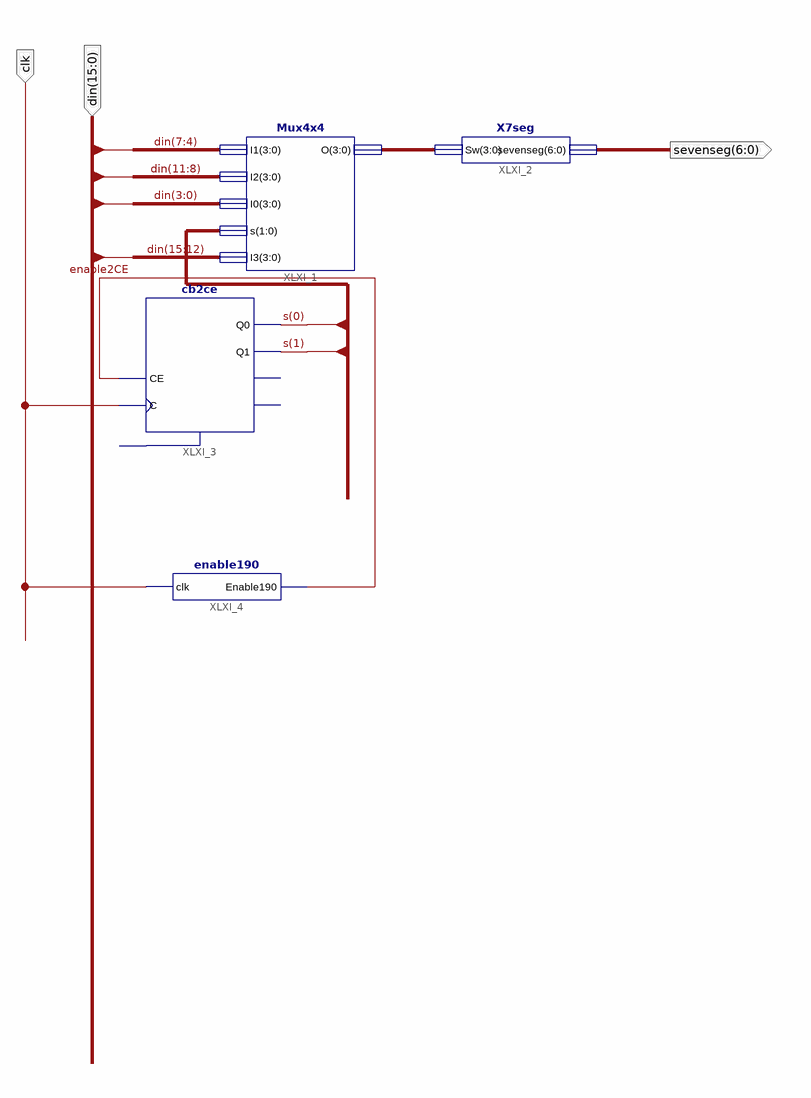
[diagram p0: schematic sheet 1]
// Xilinx ISE schematic afficheur.sch (spartan6) as structural Verilog: 4 symbols, 3 ports
module afficheur (
  input  [15:0] din,
  input  clk,
  output [6:0] sevenseg
);

  wire enable2CE;
  wire [1:0] s;
  wire [3:0] XLXN_9;

  Mux4x4 XLXI_1 (.I1(din[7:4]), .I2(din[11:8]), .I0(din[3:0]), .s(s), .I3(din[15:12]), .O(XLXN_9));
  X7seg XLXI_2 (.Sw(XLXN_9), .sevenseg(sevenseg));
  cb2ce XLXI_3 (.C(clk), .CE(enable2CE), .Q0(s[0]), .Q1(s[1]));  // open: CLR, CEO, TC
  enable190 XLXI_4 (.clk(clk), .Enable190(enable2CE));
endmodule
